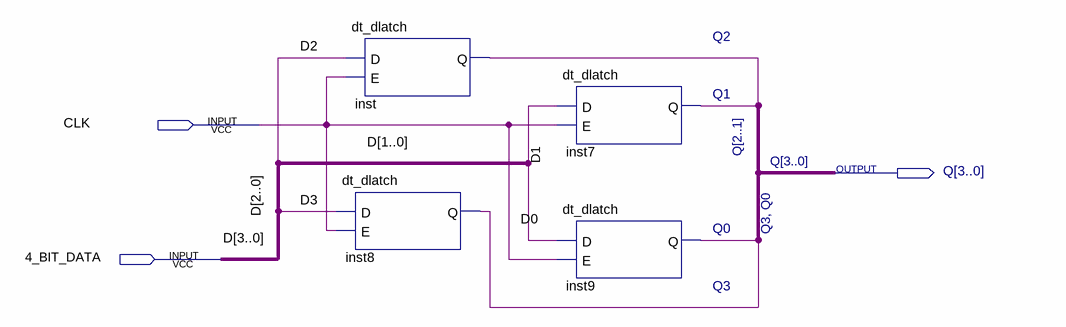
[diagram p0: schematic sheet]
// Quartus schematic aufgabe2.bdf as structural Verilog: 4 symbols, 3 pins
module aufgabe2 (
  input  CLK,
  input  \4_BIT_DATA ,
  output [3:0] Q
);

  wire [3:0] D;

  dt_dlatch inst8 (.D(D[3]), .E(CLK), .Q(Q[3]));
  dt_dlatch inst (.D(D[2]), .E(CLK), .Q(Q[2]));
  dt_dlatch inst7 (.D(D[1]), .E(CLK), .Q(Q[1]));
  dt_dlatch inst9 (.D(D[0]), .E(CLK), .Q(Q[0]));
endmodule
